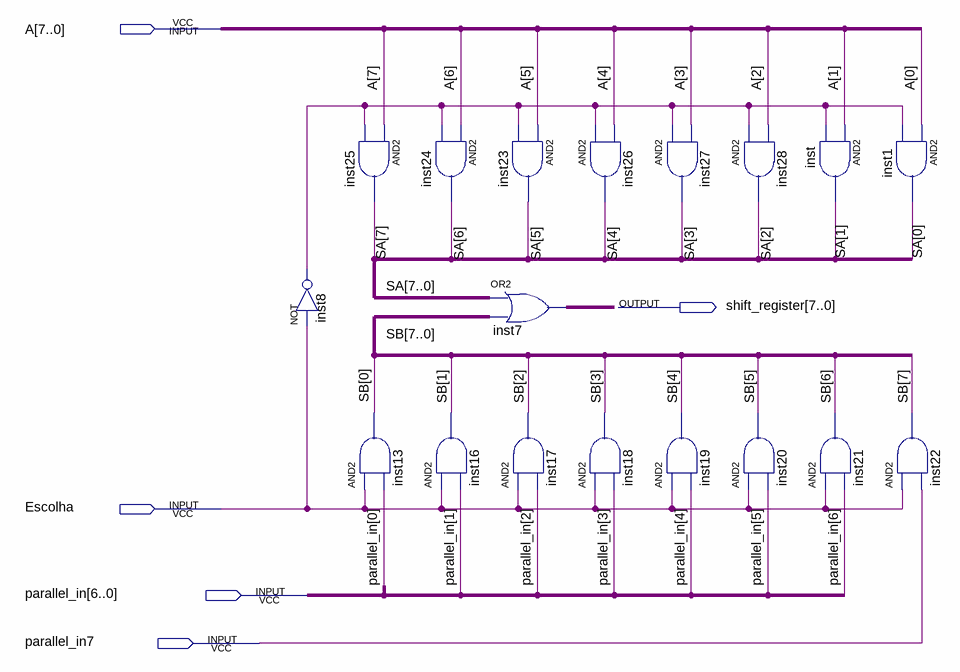
[diagram p0: schematic sheet]
// Quartus schematic Mult.bdf as structural Verilog: 18 symbols, 5 pins
module Mult (
  input  [7:0] A,
  input  Escolha,
  input  [6:0] parallel_in,
  input  parallel_in7,
  output [7:0] shift_register
);

  wire inst8_out;
  wire [7:0] SA, SB;

  not inst8 (inst8_out, Escolha);
  and inst25 (SA[7], A[7], inst8_out);
  and inst13 (SB[0], Escolha, parallel_in[0]);
  and inst24 (SA[6], A[6], inst8_out);
  and inst16 (SB[1], Escolha, parallel_in[1]);
  and inst23 (SA[5], A[5], inst8_out);
  assign shift_register = SA | SB;  // OR2 inst7, 8 bits wide
  and inst17 (SB[2], Escolha, parallel_in[2]);
  and inst26 (SA[4], inst8_out, A[4]);
  and inst18 (SB[3], Escolha, parallel_in[3]);
  and inst27 (SA[3], inst8_out, A[3]);
  and inst19 (SB[4], Escolha, parallel_in[4]);
  and inst28 (SA[2], inst8_out, A[2]);
  and inst20 (SB[5], Escolha, parallel_in[5]);
  and inst (SA[1], A[1], inst8_out);
  and inst21 (SB[6], Escolha, parallel_in[6]);
  and inst1 (SA[0], A[0], inst8_out);
  and inst22 (SB[7], Escolha, parallel_in7);
endmodule
